# EAGLE design Keg Cop - Daisy Chain Screw (EAGLE 9.6.2)
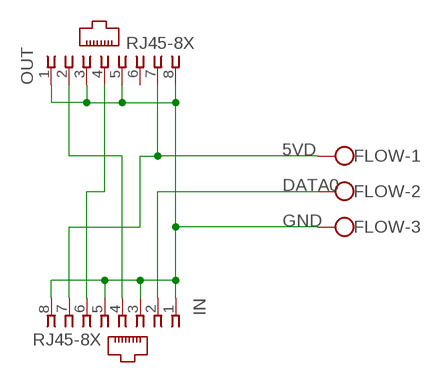
[diagram p0: schematic, sheet 1]

## Parts
FLOW  W237-103  [W237-103]
IN  RJ45-8X  [RJ45-NO-SHIELD]
OUT  RJ45-8X  [RJ45-NO-SHIELD]

## Nets
5VD: FLOW.1 IN.7 OUT.7
DATA0: FLOW.2 IN.2
DATA1: IN.4 OUT.2
DATA2: IN.6 OUT.4
GND: FLOW.3 IN.1 IN.3 IN.5 IN.8 OUT.1 OUT.3 OUT.5 OUT.8
Unconnected: OUT.6

## Library data of the parts
FLOW = con-wago-500:W237-103: WAGO SCREW CLAMP; MPN: 237-103; OC_FARNELL: unknown; OC_NEWARK: 18M7116
IN OUT = con-tycoelectronics:RJ45: CORCOM Modular RJ Jacks No Shield Source: www.tycoelectronics.com .. ENG_DS_1654001_1099_RJ_L_0507.pdf; MPN: RJ45-8X; OC_FARNELL: unknown; OC_NEWARK: 16R6101

## Board
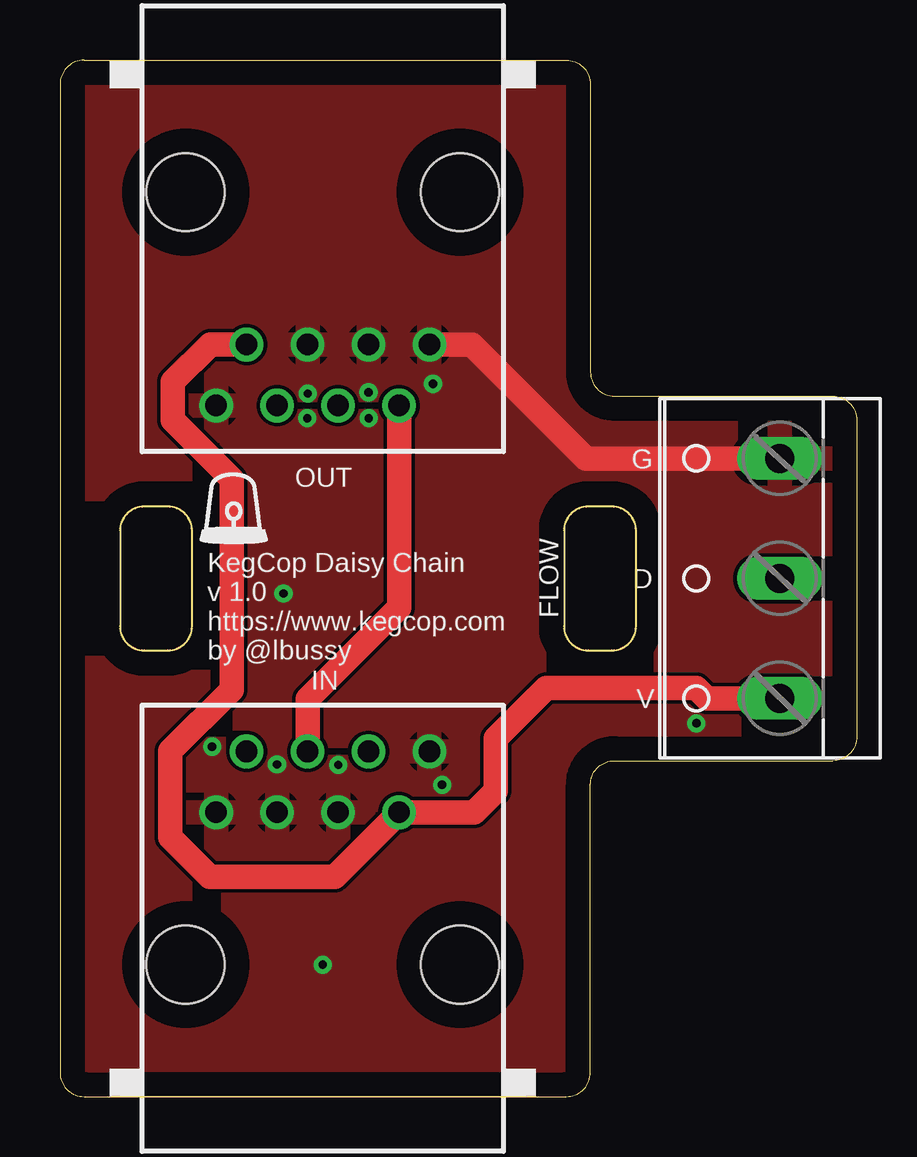
[diagram p1: board, top side]
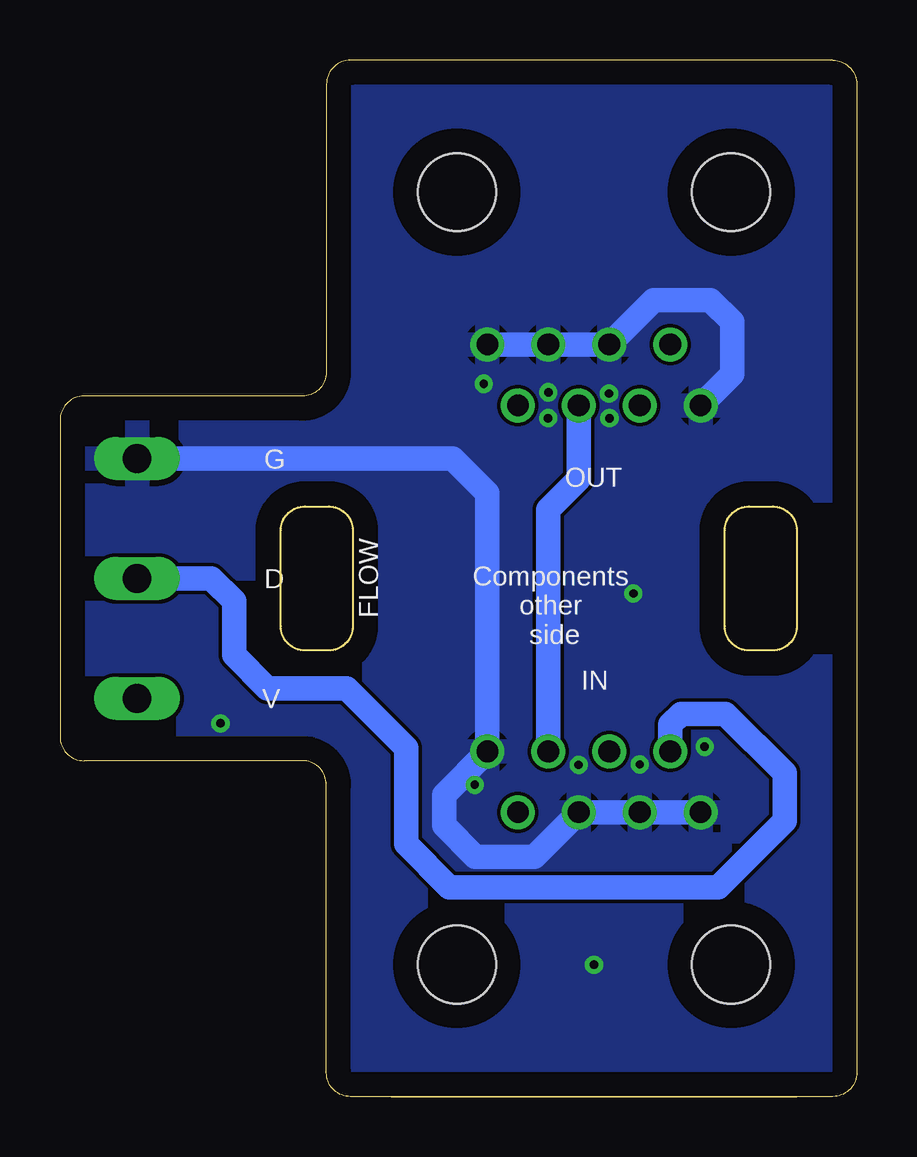
[diagram p2: board, bottom side, seen from below]

Size 33.2 x 43.22 mm. Coordinates in mm from the lower left corner, seen from the top.
Outline: 1,43.21 21.1,43.21 arc-90 22.1,42.21 22.1,30.21 arc90 23.1,29.21 32.2,29.21 arc-90 33.2,28.21 33.2,15.01 arc-90 32.2,14.01 23.1,14.01 arc90 22.1,13.01 22.1,1.01 arc-90 21.1,0.01 1,0.01 arc-90 0,1.01 0,42.21 arc-90 1,43.21
Outline: 4.5,24.61 3.5,24.61 arc90 2.5,23.61 2.5,19.61 arc90 3.5,18.61 4.5,18.61 arc90 5.5,19.61 5.5,23.61 arc90 4.5,24.61
Outline: 22,18.61 23,18.61 arc90 24,19.61 24,23.61 arc90 23,24.61 22,24.61 arc90 21,23.61 21,19.61 arc90 22,18.61
Copper layers (1*16): Top 0.035mm / dielectric 1.5mm / Bottom 0.035mm
Design rules "default *": minimum track width 6mil, minimum drill 0.35mm, track to track 6mil, track to pad 6mil, pad to pad 6mil, via to via 6mil, smd to smd 6mil, copper to edge 40mil, drill to drill 6mil, minimum pad ring 10mil, minimum via ring 8mil, stop-mask expansion 4mil, vias tented up to drill 30mil, thermal gap 10mil

### Footprints (pad centres in the part's own frame; a part is rotated, then mirrored left to right if it is on the bottom)
W237-103 = drill 1.194 long: 1 -5,-1.29; 2 0,-1.29; 3 5,-1.29
RJ45-NO-SHIELD = drill 0.9 pad 1.4: 1 -4.445,6.35; 2 -3.175,8.89; 3 -1.905,6.35; 4 -0.635,8.89; 5 0.635,6.35; 6 1.905,8.89; 7 3.175,6.35; 8 4.445,8.89 | hole 3.251: -5.715,0; 5.715,0

### Placement (x,y rotation side)
FLOW  28.7,21.61 90 top
IN  10.95,5.51 0 top
OUT  10.95,37.71 180 top

### Tracks (layer width: path | path; a pad name or v marks a point on that pad's centre or on a via)
5VD
  Top 1.016: OUT.7 6.25,31.36 4.7,29.81 4.7,28.21 7.15,25.76 7.15,16.96 4.6,14.41 4.6,10.81 6.23,9.18 11.44,9.18 IN.7 15.82,11.86 17.25,11.86 18.16,12.76 18.16,14.94 20.26,17.05 21.01,17.05 26.52,17.05 26.96,16.61 FLOW.1
DATA0
  Bottom 1.016: FLOW.2 26.89,21.61 25.94,20.66 25.94,18.42 24.56,17.03 21.26,17.03 18.77,14.55 18.77,10.54 16.97,8.74 5.77,8.74 3.01,11.5 3.01,13.51 5.47,15.97 7.32,15.97 7.78,15.52 IN.2
DATA1
  Top 1.016: IN.4 10.31,16.59 14.12,20.4 OUT.2
DATA2
  Bottom 1.016: IN.6 12.86,24.48 11.59,25.75 OUT.4
GND  (via drill 0.35)
  Top 1.016: OUT.1 17.15,31.36 21.9,26.61 FLOW.3
  Bottom 1.016: IN.1 IN.3 IN.5 13.44,10.01 15.9,10.01 17.2,11.31 17.2,12.6 IN.8 15.39,25.17 16.84,26.61 FLOW.3 | OUT.1 OUT.3 OUT.5 8.46,33.21 6.1,33.21 5.2,32.31 5.2,30.13 OUT.8
  other vias: 10.95,5.51 9.31,20.98 6.34,14.6 9.04,13.86 11.59,13.84 15.92,13.01 26.51,15.57 10.32,29.32 10.3,28.29 12.85,29.37 12.86,28.29 15.54,29.72
  pour Top: 21.1,0.01 1,0.01 arc-90 0,1.01 0,42.21 arc-90 1,43.21 21.1,43.21 arc-90 22.1,42.21 22.1,30.21 arc90 23.1,29.21 32.2,29.21 arc-90 33.2,28.21 33.2,15.01 arc-90 32.2,14.01 23.1,14.01 arc90 22.1,13.01 22.1,1.01 arc-90
  pour Bottom: 21.1,0.01 1,0.01 arc-90 0,1.01 0,42.21 arc-90 1,43.21 21.1,43.21 arc-90 22.1,42.21 22.1,30.21 arc90 23.1,29.21 32.2,29.21 arc-90 33.2,28.21 33.2,15.01 arc-90 32.2,14.01 23.1,14.01 arc90 22.1,13.01 22.1,1.01 arc-90

### Text on the board
tNames: G | D | KegCop Daisy Chain / v 1.0 / https://www.kegcop.com / by @lbussy | V
bNames: G | OUT | FLOW | D | Components / other / side | IN | V